# Altium schematic sheet YingHuoCtrl.SchDoc
size A3
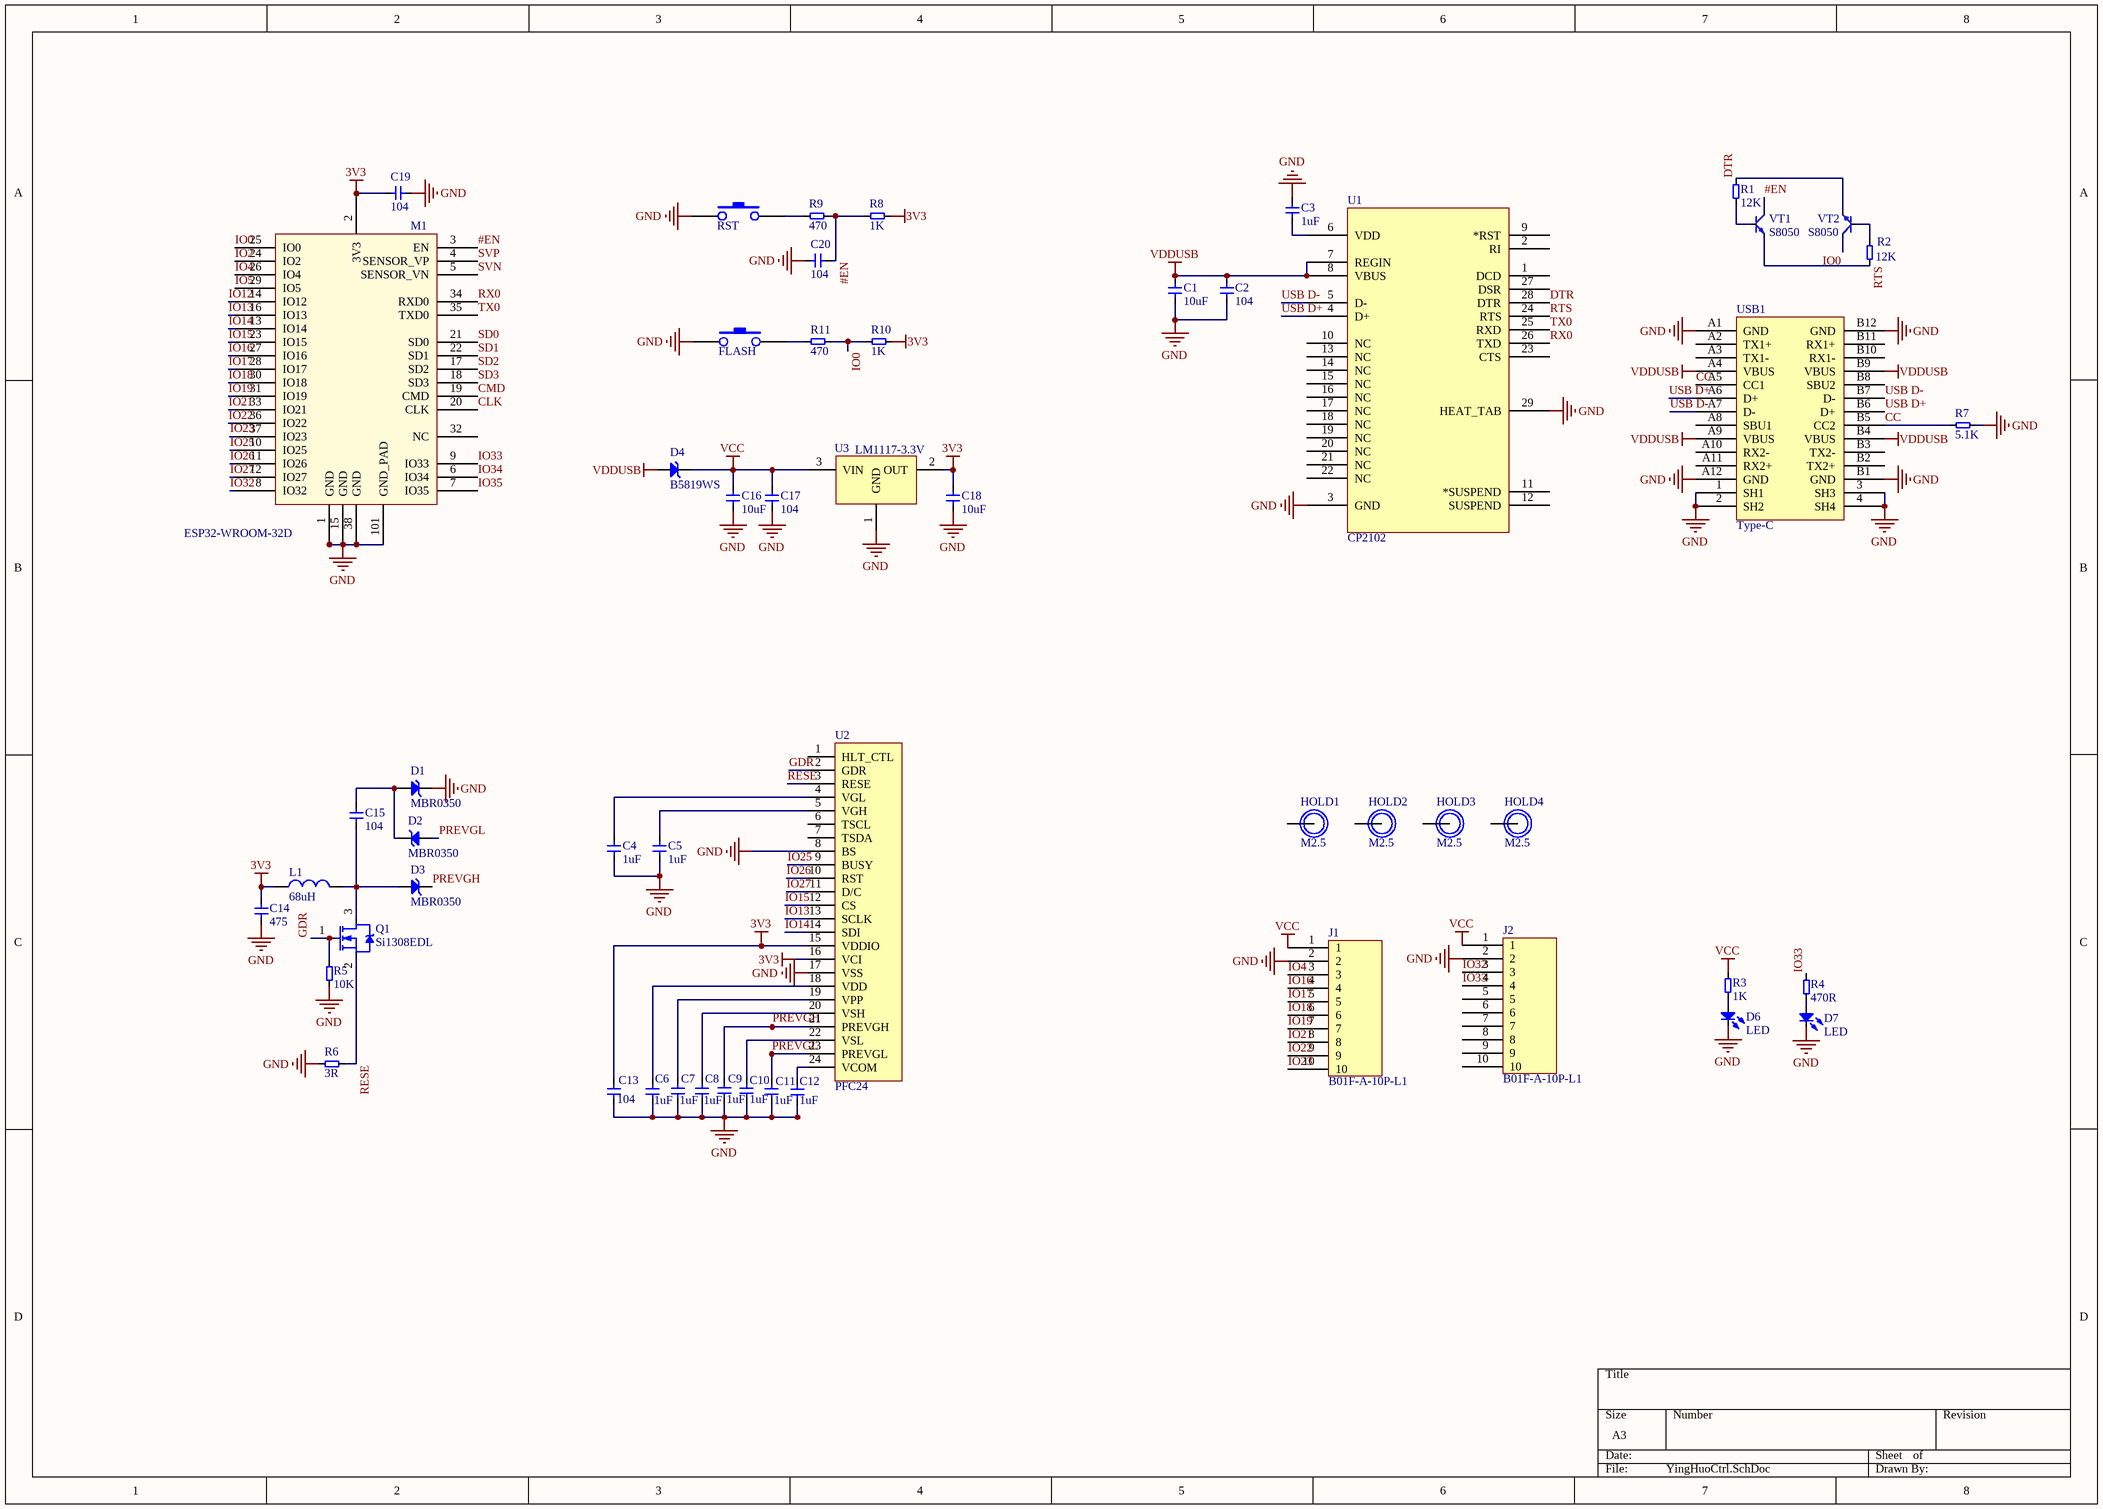
[diagram p0: YingHuoCtrl.SchDoc]

## Parts
C1  10uF  [CAP-0603]
C2  104  [CAP-0603]
C3  1uF  [CAP-0603]
C4  1uF  [CAP-0603]
C5  1uF  [CAP-0603]
C6  1uF  [CAP-0603]
C7  1uF  [CAP-0603]
C8  1uF  [CAP-0603]
C9  1uF  [CAP-0603]
C10  1uF  [CAP-0603]
C11  1uF  [CAP-0603]
C12  1uF  [CAP-0603]
C13  104  [CAP-0603]
C14  475  [CAP-1206]
C15  104  [CAP-0603]
C16  10uF  [CAP-0603]
C17  104  [CAP-1206]
C18  10uF  [CAP-1206]
C19  104  [CAP-0603]
C20  104  [CAP-0603]
D1  MBR0350  [SOD_123]
D2  MBR0350  [SOD_123]
D3  MBR0350  [SOD_123]
D4  B5819WS  [SOD_323]
D6  LED  [LED-0603]
D7  LED  [LED-0603]
FLASH  按键  [KEY_2S]  (value not drawn)
HOLD1  M2.5  [Hold_M2.5S]
HOLD2  M2.5  [Hold_M2.5S]
HOLD3  M2.5  [Hold_M2.5S]
HOLD4  M2.5  [Hold_M2.5S]
J1  B01F-A-10P-L1  [JL-B01F-10]
J2  B01F-A-10P-L1  [JL-B01F-10]
L1  68uH  [L-SMD-3D16]
M1  ESP32-WROOM-32D  [ESP32S]
Q1  Si1308EDL  [SOT-23-3]
R1  12K  [R-0603]
R2  12K  [R-0603]
R3  1K  [R-0603]
R4  470R  [R-0603]
R5  10K  [R-0603]
R6  3R  [R-0603]
R7  5.1K  [R-0603]
R8  1K  [R-0603]
R9  470  [R-0603]
R10  1K  [R-0603]
R11  470  [R-0603]
RST  按键  [KEY_2S]  (value not drawn)
U1  CP2102  [QFN50P500X500X80_HS-29N]
U2  PFC24  [FPC0.5 2H-WS-24P]
U3  LM1117-3.3V  [SOT-223]
USB1  Type-C  [Type-C]
VT1  S8050  [SOT-23-3]
VT2  S8050  [SOT-23-3]

## Nets
3V3: C13.1 C14.2 C18.2 C19.1 L1.1 M1.2(3V3) R8.2 R10.2 U2.15(VDDIO) U2.16(VCI) U3.2(OUT)
GND: C1.1 C2.1 C3.2 C4.2 C5.2 C6.2 C7.2 C8.1 C9.1 C10.1 C11.1 C12.1 C13.2 C14.1 C16.1 C17.1 C18.1 C19.2 C20.1 D1.2 D6.2 D7.2 FLASH.1 J1.2 J2.2 M1.1(GND) M1.15(GND) M1.38(GND) M1.101(GND_PAD) R5.1 R6.2 R7.2 RST.1 U1.3(GND) U1.29(HEAT_TAB) U2.8(BS) U2.17(VSS) U3.1(GND) USB1.1(SH1) USB1.2(SH2) USB1.3(SH3) USB1.4(SH4) USB1.A1(GND) USB1.A12(GND) USB1.B1(GND) USB1.B12(GND)
VCC: C16.2 C17.2 D4.2 J1.1 J2.1 R3.1 U3.3(VIN)
VDDUSB: C1.2 C2.2 D4.1 U1.7(REGIN) U1.8(VBUS) USB1.A4(VBUS) USB1.A9(VBUS) USB1.B4(VBUS) USB1.B9(VBUS)
#EN: C20.2 M1.3(EN) R8.1 R9.2 VT1.3(C)
CC: R7.1 USB1.A5(CC1) USB1.B5(CC2)
CLK: M1.20(CLK)
CMD: M1.19(CMD)
DTR: R1.2 U1.28(DTR) VT2.2(E)
GDR: Q1.1(G) R5.2 U2.2(GDR)
IO0: M1.25(IO0) R10.1 R11.2 VT2.3(C)
IO2: M1.24(IO2)
IO4: J1.3 M1.26(IO4)
IO5: M1.29(IO5)
IO12: M1.14(IO12)
IO13: M1.16(IO13) U2.13(SCLK)
IO14: M1.13(IO14) U2.14(SDI)
IO15: M1.23(IO15) U2.12(CS)
IO16: J1.4 M1.27(IO16)
IO17: J1.5 M1.28(IO17)
IO18: J1.6 M1.30(IO18)
IO19: J1.7 M1.31(IO19)
IO21: J1.8 M1.33(IO21)
IO22: J1.9 M1.36(IO22)
IO23: J1.10 M1.37(IO23)
IO25: M1.10(IO25) U2.9(BUSY)
IO26: M1.11(IO26) U2.10(RST)
IO27: M1.12(IO27) U2.11(D/C)
IO32: J2.3 M1.8(IO32)
IO33: J2.4 M1.9(IO33) R4.1
IO34: M1.6(IO34)
IO35: M1.7(IO35)
PREVGH: C9.2 D3.2 U2.21(PREVGH)
PREVGL: C11.2 D2.1 U2.23(PREVGL)
RESE: Q1.2(S) R6.1 U2.3(RESE)
RTS: R2.1 U1.24(RTS) VT1.2(E)
RX0: M1.34(RXD0) U1.26(TXD)
SD0: M1.21(SD0)
SD1: M1.22(SD1)
SD2: M1.17(SD2)
SD3: M1.18(SD3)
SVN: M1.5(SENSOR_VN)
SVP: M1.4(SENSOR_VP)
TX0: M1.35(TXD0) U1.25(RXD)
USB D+: U1.4(D+) USB1.A6(D+) USB1.B6(D+)
USB D-: U1.5(D-) USB1.A7(D-) USB1.B7(D-)
NetC3_1: C3.1 U1.6(VDD)
NetC4_1: C4.1 U2.4(VGL)
NetC5_1: C5.1 U2.5(VGH)
NetC6_1: C6.1 U2.18(VDD)
NetC7_1: C7.1 U2.19(VPP)
NetC8_2: C8.2 U2.20(VSH)
NetC10_2: C10.2 U2.22(VSL)
NetC12_2: C12.2 U2.24(VCOM)
NetC15_1: C15.1 D3.1 L1.2 Q1.3(D)
NetC15_2: C15.2 D1.1 D2.2
NetD6_1: D6.1 R3.2
NetD7_1: D7.1 R4.2
NetFLASH_2: FLASH.2 R11.1
NetR1_1: R1.1 VT1.1(B)
NetR2_2: R2.2 VT2.1(B)
NetR9_1: R9.1 RST.2

Not connected (* = marked no-connect by the designer): HOLD1 1; HOLD2 1; HOLD3 1; HOLD4 1; J2 5 6 7 8 9 10; M1 32(NC); U1 1(DCD) 2(RI) 9(*RST) 10(NC) 11(*SUSPEND) 12(SUSPEND) 13(NC) 14(NC) 15(NC) 16(NC) 17(NC) 18(NC) 19(NC) 20(NC) 21(NC) 22(NC) 23(CTS) 27(DSR); U2 1(HLT_CTL) 6(TSCL) 7(TSDA); USB1 A2(TX1+) A3(TX1-) A8(SBU1) A10(RX2-) A11(RX2+) B2(TX2+) B3(TX2-) B8(SBU2) B10(RX1-) B11(RX1+)

## Library data of the parts
C1-C20 = CAP
D1-D4 = TVS
HOLD1-HOLD4 = Hold_M3
J1 J2 = HDR1x10
L1 = Inductor: 电感
M1 = ESP32S_Module: Esp-32S; Datasheet: https://espressif.com/sites/default/files/documentation/esp_wroom_32_datasheet_en.pdf
Q1 = MOS-N
R1-R11 = Res
U1 = CP2102: Imported; PART DESC: SINGLE-CHIP USB TO UART BRIDGE, QFN28, RoHS.; MFG #1: SILICON LABS; PART NUMBER: CP2102; Value: Value; RefDes: RefDes; Type: DEV
VT1 VT2 = BJT_NPN: Transistor